# Altium project n21-dvt.PrjPcb (part 2 of 2)

## Sheet NOTECARD.SchDoc
size A3; SheetNumber: 4; SheetTotal: 7
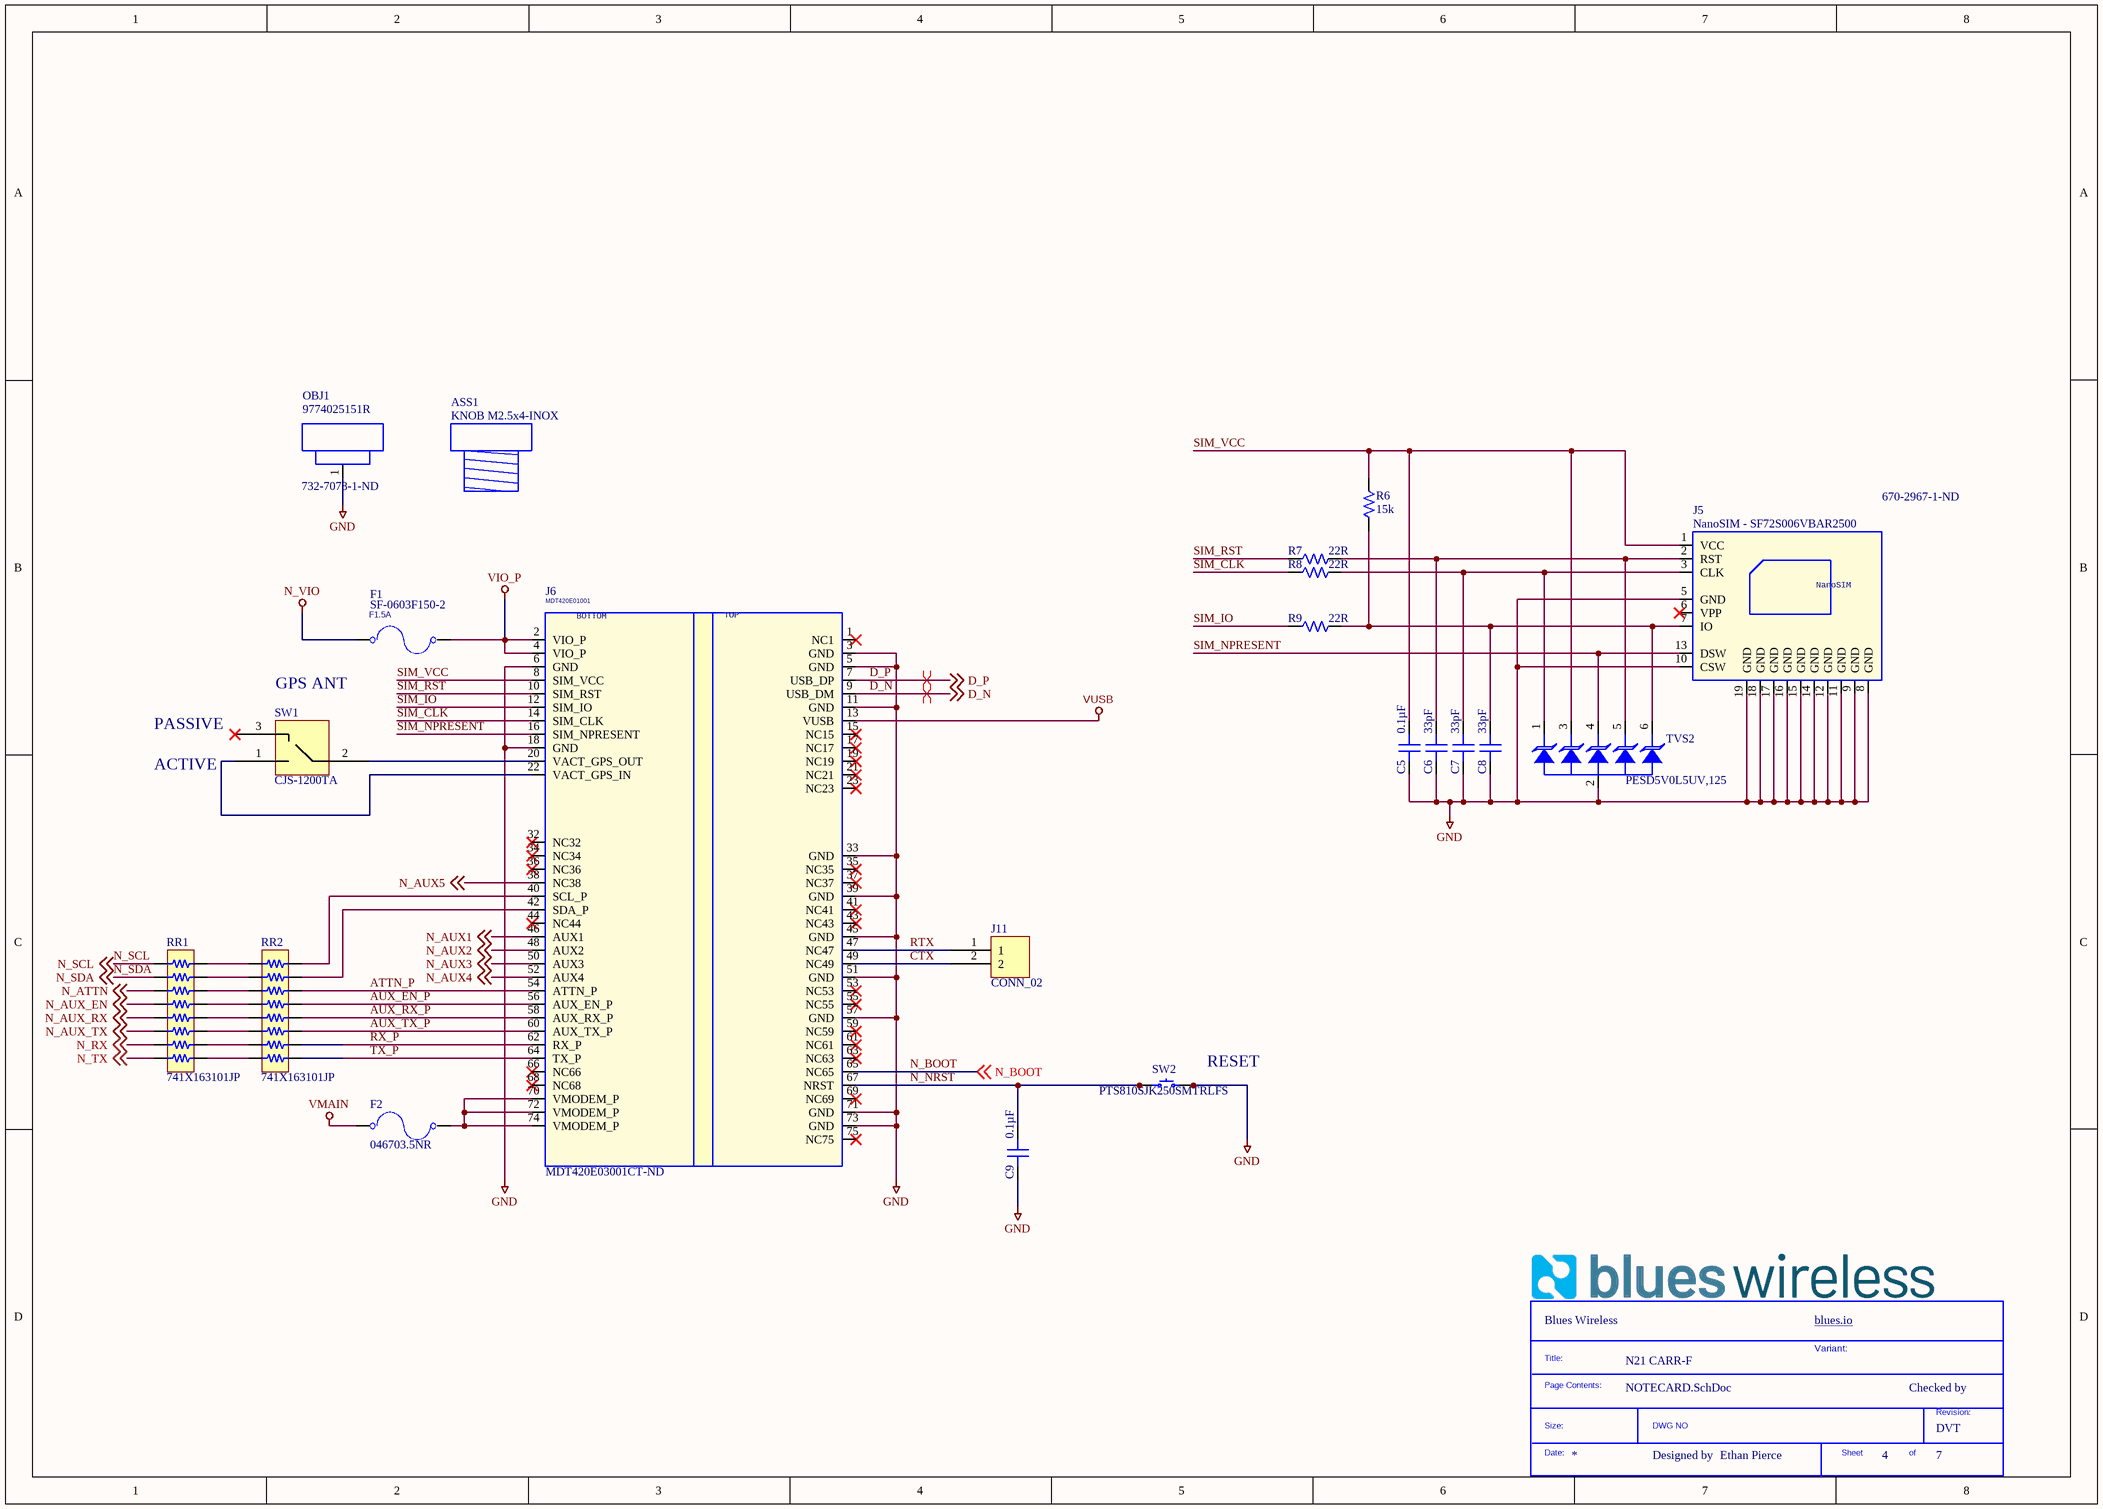
[diagram p2: NOTECARD.SchDoc]

### Parts
(Parts that share a designator on the sheet are numbered #1, #2 ... from top to bottom, then left to right.)
*?#3  SDTitleBlock  (value not drawn)  (graphical)
ASS1  KNOB M2.5x4-INOX  (mechanical)
C5  0.1µF  [CAP 0402_1005]
C6  33pF  [CAP 0402_1005]
C7  33pF  [CAP 0402_1005]
C8  33pF  [CAP 0402_1005]
C9  0.1µF  [CAP 0402_1005]
F1  SF-0603F150-2  [FS-0603]
F2  046703.5NR  [FS-0603]
J5  NanoSIM - SF72S006VBAR2500  Supplier Part Number 1: 670-2967-1-ND  [J-NANOSIM-SF72S006VBA]
J6  MDT420E01001  Supplier Part Number 1: MDT420E03001CT-ND  [J-75-0050-MOS-M2]
J11  CONN_02  [CONN_02]  (no BOM)
OBJ1  9774025151R  Supplier Part Number 1: 732-7078-1-ND  [DIST-WASMSIM0250]
R6  15k  [RES 0402_1005]
R7  22R  [RES 0402_1005]
R8  22R  [RES 0402_1005]
R9  22R  [RES 0402_1005]
RR1  741X163101JP  [RESNET 1506-16 CONVEX]
RR2  741X163101JP  [RESNET 1506-16 CONVEX]
SW1  CJS-1200TA  [SW_CJS-1200TA]
SW2  PTS810SJK250SMTRLFS  [C&K PTS810]
TVS2  PESD5V0L5UV,125  [SOT666]

### Nets
GND: C5.1 C6.1 C7.1 C8.1 C9.1 J5.5(GND) J5.8(GND) J5.9(GND) J5.10(CSW) J5.11(GND) J5.12(GND) J5.14(GND) J5.15(GND) J5.16(GND) J5.17(GND) J5.18(GND) J5.19(GND) J6.3(GND) J6.5(GND) J6.6(GND) J6.11(GND) J6.18(GND) J6.33(GND) J6.39(GND) J6.45(GND) J6.51(GND) J6.57(GND) J6.71(GND) J6.73(GND) OBJ1.1 SW2.3 SW2.4 TVS2.2(A2)
N_VIO: F1.1
VIO_P: F1.2 J6.2(VIO_P) J6.4(VIO_P)
VMAIN: F2.1
VUSB: J6.13(VUSB)
ATTN_P: J6.54(ATTN_P) RR2.14
AUX_EN_P: J6.56(AUX_EN_P) RR2.13
AUX_RX_P: J6.58(AUX_RX_P) RR2.12
AUX_TX_P: J6.60(AUX_TX_P) RR2.11
CTX: J6.49(NC49) J11.2
D_N: J6.9(USB_DM) ; off-sheet D_N
D_P: J6.7(USB_DP) ; off-sheet D_P
N_ATTN: RR1.3 ; off-sheet N_ATTN
N_AUX1: J6.46(AUX1) ; off-sheet N_AUX1
N_AUX2: J6.48(AUX2) ; off-sheet N_AUX2
N_AUX3: J6.50(AUX3) ; off-sheet N_AUX3
N_AUX4: J6.52(AUX4) ; off-sheet N_AUX4
N_AUX5: J6.38(NC38) ; off-sheet N_AUX5
N_AUX_EN: RR1.4 ; off-sheet N_AUX_EN
N_AUX_RX: RR1.5 ; off-sheet N_AUX_RX
N_AUX_TX: RR1.6 ; off-sheet N_AUX_TX
N_BOOT: J6.65(NC65) ; off-sheet N_BOOT
N_NRST: C9.2 J6.67(NRST) SW2.1 SW2.2
N_RX: RR1.7 ; off-sheet N_RX
N_SCL: RR1.1 ; off-sheet N_SCL
N_SDA: RR1.2 ; off-sheet N_SDA
N_TX: RR1.8 ; off-sheet N_TX
RTX: J6.47(NC47) J11.1
RX_P: J6.62(RX_P) RR2.10
SIM_CLK: J6.14(SIM_CLK) R8.1
SIM_IO: J6.12(SIM_IO) R9.1
SIM_NPRESENT: J5.13(DSW) J6.16(SIM_NPRESENT) TVS2.4(C4)
SIM_RST: J6.10(SIM_RST) R7.1
SIM_VCC: C5.2 J5.1(VCC) J6.8(SIM_VCC) R6.2 TVS2.3(C3)
TX_P: J6.64(TX_P) RR2.9
NetC6_2: C6.2 J5.2(RST) R7.2 TVS2.5(A5)
NetC7_2: C7.2 J5.3(CLK) R8.2 TVS2.1(C1)
NetC8_2: C8.2 J5.7(IO) R6.1 R9.2 TVS2.6(C6)
NetF2_2: F2.2 J6.70(VMODEM_P) J6.72(VMODEM_P) J6.74(VMODEM_P)
NetJ6_20: J6.20(VACT_GPS_OUT) SW1.2
NetJ6_22: J6.22(VACT_GPS_IN) SW1.1
NetJ6_40: J6.40(SCL_P) RR2.16
NetJ6_42: J6.42(SDA_P) RR2.15
NetRR1_9: RR1.9 RR2.8
NetRR1_10: RR1.10 RR2.7
NetRR1_11: RR1.11 RR2.6
NetRR1_12: RR1.12 RR2.5
NetRR1_13: RR1.13 RR2.4
NetRR1_14: RR1.14 RR2.3
NetRR1_15: RR1.15 RR2.2
NetRR1_16: RR1.16 RR2.1

Not connected (* = marked no-connect by the designer): J5 6(VPP)*; J6 1(NC1)* 15(NC15)* 17(NC17)* 19(NC19)* 21(NC21)* 23(NC23)* 32(NC32)* 34(NC34)* 35(NC35)* 36(NC36)* 37(NC37)* 41(NC41)* 43(NC43)* 44(NC44)* 53(NC53)* 55(NC55)* 59(NC59)* 61(NC61)* 63(NC63)* 66(NC66)* 68(NC68)* 69(NC69)* 75(NC75)*; SW1 3*

### Layout directives
differential pair: D_N, D_P

### Notes on the sheet
- GPS ANT
- ACTIVE
- PASSIVE
- (near SW2) RESET
- Variant:
- Checked by
- Designed by
- (in symbol AMPHENOL-75 - M-2 KEY E_13) BOTTOM; TOP
- (in symbol RAPIDO - SF-0603F150-2-1.5A/32V) F1.5A
- (in symbol SDTitleBlock) Title:; Page Contents:; Revision:; Size:; DWG NO; Date:; Sheet; of

### Library data of the parts
ASS1 = KNOB - M2.5x4-INOX: VITE TCEI 2.5X4 ESAGONO INCASSATO A2 INOX; Pkg Type: THT; Famiglia: MECCANICA; Caratteristiche: M2.5; Price Distributor Cad: 0,06; Modello: KNOB
C5 C9 = CL05B104KO5NNNC: CAP CER 0.1UF 16V X7R 0402; Manufacturer: Samsung Electro-Mechanics; Tolerance: ±10%; Part Number: CL05B104KO5NNNC; Value: 0.1µF; Applications: General Purpose; Capacitance: 0.1µF; ComponentLink1Description: Datasheet; ComponentLink1URL: http://www.samsungsem.com/kr/support/product-search/mlcc/CL05B104KO5NNNC.jsp; ComponentLink2Description: DigiKey Link; ComponentLink2URL: http://digikey.com/product-detail/en/samsung-electro-mechanics/CL05B104KO5NNNC/1276-1001-1-ND/3889087; Device Package: 0402 (1005 Metric); LastUpdated: 9/2/2020 1:02:15 AM; Lifecycle Status: Active; Minimum Order: 1; Mounting Type: Surface Mount, MLCC; Operating Temperature: -55°C ~ 125°C; Package / Case: 0402 (1005 Metric); Packaging: CutTape; PartId: 6066; Part Status: Active; Price: 0.10; Series: CL; Size / Dimension: 0.039" L x 0.020" W (1.00mm x 0.50mm); Supplier 1: DigiKey; Supplier Part Number 1: 1276-1001-1-ND; Temperature Coefficient: X7R; Thickness (Max): 0.022" (0.55mm); Voltage - Rated: 16V
C6-C8 = CL05C330JB5NNNC: CAP CER 33PF 50V C0G/NP0 0402; Manufacturer: Samsung Electro-Mechanics; Temperature Coefficient: C0G, NP0; Tolerance: ±5%; Part Number: CL05C330JB5NNNC; Value: 33pF; Applications: General Purpose; Capacitance: 33pF; ComponentLink1Description: Datasheet; ComponentLink1URL: http://www.samsungsem.com/kr/support/product-search/mlcc/CL05C330JB5NNNC.jsp; ComponentLink2Description: DigiKey Link; ComponentLink2URL: http://digikey.com/product-detail/en/samsung-electro-mechanics/CL05C330JB5NNNC/1276-1272-1-ND/3889358; Device Package: 0402 (1005 Metric); LastUpdated: 9/2/2020 1:02:02 AM; Lifecycle Status: Active; Minimum Order: 1; Mounting Type: Surface Mount, MLCC; Operating Temperature: -55°C ~ 125°C; Package / Case: 0402 (1005 Metric); Packaging: CutTape; PartId: 11655; Part Status: Active; Price: 0.10; Series: CL; Size / Dimension: 0.039" L x 0.020" W (1.00mm x 0.50mm); Supplier 1: DigiKey; Supplier Part Number 1: 1276-1272-1-ND; Thickness (Max): 0.022" (0.55mm); Voltage - Rated: 50V
F1 = RAPIDO - SF-0603F150-2-1.5A/32V: FUSIBILE RAPIDO 1.5A 32V 0603 SF-0603F150-2 BOURNS SMT; Database: 32505; Pkg Type: SMD; Temp Range: -40°..+105°; Caratteristiche: 1.5A/32V; Distributor: FAE; Famiglia: FUSIBILE; Modello: RAPIDO; Price Distributor Cad: 0,1669; Manufacturer Part Number 1: SF-0603F150-2; PCB Footprint: FS-0603; Manufacturer 1: BOURNS
F2 = 046703.5NR: Fuse Chip Very Fast Acting 3.5A 32V SMD Solder Pad 0603 T/R CSA; Manufacturer 1: Littelfuse; Body Material: Thermoplastic; DC Cold Resistance: 13.9mR; Fuse Type: Board Mount (Cartridge Style Excluded); Resistance: 15mR; Power Dissipation: 259.9mW; Approvals: UL,CSA; Supplier 1: Digi-Key; Manufacturer Part Number 1: 046703.5NR; RoHS: Yes; Category: Fuses; Stock 1: 384; Pricing 1: 1=1.35000, 5=1.31000, 10=1.22600, 50=1.01440, 100=0.84540, 250=0.82428, 500=0.69746, 1000=0.61292 (USD); Mount: Surface Mount; Case/Package: 0603; Case Code (Metric): 1608; Case Code (Imperial): 0603; Min Operating Temperature: -55°C; Max Operating Temperature: 90°C; Voltage Rating (AC): 32V; Voltage Rating (DC): 32V; Current Rating: 3.5A; Packaging: Tape and Reel; Package Quantity: 5000; Series: 467; Voltage Rating: 32V; Termination: SMD/SMT; Fuse Current: 3.5A; Working Voltage: 32V; Length: 1.6mm; Width: 1.09mm; Height: 0.012inch; Depth: 0.81mm; RoHS Compliant: Yes; REACH SVHC: Unknown; Lead Free: Lead Free; ComponentLink1URL: https://datasheet.ciiva.com/299/467-299333.pdf?src-supplier=Digi-Key; ComponentLink1Description: https://datasheet.ciiva.com/299/467-299333.pdf?src-supplier=Digi-Key; ComponentLink2URL: https://datasheet.ciiva.com/299/467-299334.pdf?src-supplier=Digi-Key; ComponentLink2Description: https://datasheet.ciiva.com/299/467-299334.pdf?src-supplier=Digi-Key; ComponentLink3URL: https://datasheet.ciiva.com/299/467-299335.pdf?src-supplier=Digi-Key; ComponentLink3Description: https://datasheet.ciiva.com/299/467-299335.pdf?src-supplier=Digi-Key; ComponentLink4URL: https://datasheet.ciiva.com/1549/48494-1549730.pdf?src-supplier=Element14; ComponentLink4Description: https://datasheet.ciiva.com/1549/48494-1549730.pdf?src-supplier=Element14; ComponentLink5URL: https://datasheet.ciiva.com/16327/467-16327451.pdf?src-supplier=Future+Electronics; ComponentLink5Description: https://datasheet.ciiva.com/16327/467-16327451.pdf?src-supplier=Future+Electronics; Supplier Part Number 1: F1400CT-ND
J5 = NANOSIM - J-NANOSIM-SF72S006VBA: CONN. NANOSIM 8P F/90° PUSH-PUSH SF72S006VBAR2500 JAE ELECTRONICS SMT; Pkg Type: SMD; Temp Range: -25°..+85°; Database: 41049; Famiglia: CONNETTORE; ROOM: NANO-SIM; Distributor: FAE; Price Distributor Cad: 0,7362; Modello: NanoSIM; PCB Footprint: J-NANOSIM-SF72S006VBA; Supplier 1: Digi-Key
J6 = AMPHENOL-75 - M-2 KEY E_13: CONN. M.2 75P M/90° P=0.5 MDT420E01001 AMPHENOL SMT; Famiglia: CONNETTORE; Pkg Type: SMD; Temp Range: -40°..+80°; ROOM: M2 CONNECTOR; PCB Footprint: J-75-0050-MOS-M2-E; Caratteristiche: 75P; Distributor: D-MDT420E01001CT-ND; Price Distributor Cad: 1,21; Supplier 1: Digi-Key
J11 = CONN_02: 0,1" 2 PIN Header
OBJ1 = DISTANZIALE - M2.5x0250: DISTANZ. CIL. METALLO 5.1X2.5 9774025151R W.E SMT; Pkg Type: SMD; Famiglia: MECCANICA; Database: 44635; Caratteristiche: M2.5; Price Distributor Cad: 0,6225; Modello: DISTANZIALE; Distributor: FAE; PCB Footprint: DIST-WASMSIM0250; Supplier 1: Digi-Key
R6 = PFR05S-153-FNH: Res SMD 15 Kohm 1% 1/16W 0402; Manufacturer: Cyntec; Supplier 1: Digi-Key; Manufacturer Part Number: PFR05S-153-FNH; RoHS: Yes; Category: Chip SMD Resistors; Stock 1: 3928; Pricing 1: 1=0.10000, 10=0.01500, 100=0.00590, 1000=0.00265, 2500=0.00230, 5000=0.00190 (USD); RoHS Compliant: Yes; Supplier Part Number 1: 2037-PFR05S-153-FNHCT-ND
R7-R9 = RC0402FR-0722RL: Res Thick Film 0402 22 Ohm 1% 0.063W(1/16W) ±100ppm/C Pad SMD T/R; Manufacturer: Yageo; Voltage Rating: 50V; Power Rating: 63mW; Temperature Coefficient: 100ppm/°C; Supplier 1: Digi-Key; Manufacturer Part Number: RC0402FR-0722RL; RoHS: Yes; Category: Chip SMD Resistors; Stock 1: 1796; Pricing 1: 1=0.10000, 10=0.01600, 100=0.00660, 1000=0.00299, 2500=0.00259, 5000=0.00214 (USD); Case/Package: 0402; Number of Pins: 2; Case Code (Imperial): 0402; Case Code (Metric): 1005; Size Code: 0402; Min Operating Temperature: -55°C; Max Operating Temperature: 155°C; Resistor Type: Thick Film; Voltage Rating (DC): 50V; Resistance: 22R; Tolerance: 1%; Packaging: Tape and Reel; Termination: SMD/SMT; Features: Moisture Resistant; Series: RC; Max Power Dissipation: 63mW; Number of Terminations: 2; Resistance Tolerance: 1%; Technology: THICK FILM; Construction: Rectangular; Length: 1mm; Width: 0.5mm; Height: 0.32mm; Depth: 0.5mm; RoHS Compliant: Yes; REACH SVHC: Unknown; Military Standard: Not; Lead Free: Lead Free; ComponentLink1URL: https://datasheet.ciiva.com/11819/0900766b80c66297-11819462.pdf?src-supplier=RSComponents; ComponentLink1Description: https://datasheet.ciiva.com/11819/0900766b80c66297-11819462.pdf?src-supplier=RSComponents; ComponentLink2URL: https://datasheet.ciiva.com/16930/pyu-rc0402-51-rohs-l-6-r-16930687.pdf?src-supplier=Future+Electronics; ComponentLink2Description: https://datasheet.ciiva.com/16930/pyu-rc0402-51-rohs-l-6-r-16930687.pdf?src-supplier=Future+Electronics; ComponentLink3URL: https://datasheet.ciiva.com/7849/1018594-7849911.pdf?src-supplier=Element14; ComponentLink3Description: https://datasheet.ciiva.com/7849/1018594-7849911.pdf?src-supplier=Element14; ComponentLink4URL: https://datasheet.ciiva.com/7849/1018594-7849912.pdf?src-supplier=Element14; ComponentLink4Description: https://datasheet.ciiva.com/7849/1018594-7849912.pdf?src-supplier=Element14; ComponentLink5URL: https://datasheet.ciiva.com/26829/getdatasheetpartid-554995-26829991.pdf?src-supplier=Verical; ComponentLink5Description: https://datasheet.ciiva.com/26829/getdatasheetpartid-554995-26829991.pdf?src-supplier=Verical; Supplier Part Number 1: 311-22.0LRCT-ND
RR1 RR2 = 741X163101JP: RES ARRAY 8 RES 100 OHM 1506; Manufacturer: CTS Resistor Products; Circuit Type: Isolated; Number of Resistors: 8; Power Per Element: 62.5mW; Resistance (Ohms): 100; Temperature Coefficient: ±200ppm/°C; Tolerance: ±5%; Part Number: 741X163101JP; ComponentLink1Description: Datasheet; ComponentLink1URL: https://www.ctscorp.com/wp-content/uploads/74x.pdf; ComponentLink2Description: DigiKey Link; ComponentLink2URL: http://digikey.com/product-detail/en/cts-resistor-products/741X163101JP/741X163101JPCT-ND/1124597; Height - Seated (Max): 0.022" (0.55mm); LastUpdated: 9/2/2020 1:23:29 AM; Lifecycle Status: Active; Minimum Order: 1; Mounting Type: Surface Mount; Number of Pins: 16; Operating Temperature: -55°C ~ 125°C; Package / Case: 1506, Convex, Long Side Terminals; Packaging: TapeAndReel; PartId: 627; Part Status: Active; Price: 0.07; Series: 741; Size / Dimension: 0.156" L x 0.063" W (3.95mm x 1.60mm); Supplier 1: DigiKey; Supplier Part Number 1: 741X163101JPCT-ND
SW1 = CJS-1200TA: Switch Slide N.O./N.C. SPDT Raised Slide 0.1A 24VDC J-Hook SMD Embossed T/R; Manufacturer: Nidec Copal; Body Material: Polyphenylene; Voltage Rating (DC): 6V; Electrical Life: 200Cycles; Max Voltage Rating (DC): 24V; Current Rating: 100mA; Number of Positions: 2; Actuator Type: Slide (Standard); Washable: Yes; Supplier 1: Digi-Key; Manufacturer Part Number: CJS-1200TA; RoHS: Yes; Category: Slide Switches; Pricing 1: 1=0.81000, 10=0.78400, 25=0.75440, 100=0.65470, 250=0.59736, 500=0.55510 (USD); Mount: Surface Mount; Contact Material: Copper Alloy; Contact Plating: Gold; Min Operating Temperature: -40°C; Max Operating Temperature: 85°C; Packaging: Tape and Reel; Throw Configuration: SPDT; Termination: J-Hook; Series: CJS; Orientation: Vertical; Length: 0.212inch; Radiation Hardening: No; RoHS Compliant: Yes; Lead Free: Lead Free; ComponentLink1URL: https://datasheet.ciiva.com/2864/cjs-2864476.pdf?src-supplier=Digi-Key; ComponentLink1Description: https://datasheet.ciiva.com/2864/cjs-2864476.pdf?src-supplier=Digi-Key; ComponentLink2URL: https://datasheet.ciiva.com/2864/cjs-2864477.pdf?src-supplier=Digi-Key; ComponentLink2Description: https://datasheet.ciiva.com/2864/cjs-2864477.pdf?src-supplier=Digi-Key; ComponentLink3URL: https://datasheet.ciiva.com/2864/cjs-2864478.pdf?src-supplier=Digi-Key; ComponentLink3Description: https://datasheet.ciiva.com/2864/cjs-2864478.pdf?src-supplier=Digi-Key; Supplier Part Number 1: 563-1021-6-ND
SW2 = PTS810SJK250SMTRLFS: PTS810 Series SPST Off-MOM 0.05 A 16 V Top Actuated SMT Tactile Switch; Manufacturer: ITT C&K; Mechanical Life: 50000Cycles; Operating Force: 260gf; Max Current Rating: 50mA; Voltage Rating (DC): 16V; Illumination Type: Non-Illuminated; Switch Travel: 0.15mm; Actuator Type: Standard; Supplier 1: Digi-Key; Manufacturer Part Number: PTS810SJK250SMTRLFS; RoHS: Yes; Category: Tactile Switches; Stock 1: 57; Pricing 1: 1=0.34000, 10=0.32600, 25=0.30880, 100=0.27980, 250=0.25504, 500=0.23706, 1000=0.20223 (USD); Mount: Surface Mount; Case/Package: SMD/SMT; Color: White; Contact Plating: Silver; Min Operating Temperature: -40°C; Max Operating Temperature: 85°C; Throw Configuration: SPST; Packaging: Tape and Reel; Termination: J-Bend; Current Rating: 50mA; Package Quantity: 2900; Orientation: Straight; Switch Function: Off-Mom; Length: 3.2mm; Depth: 4.6mm; Lead Free: Lead Free; RoHS Compliant: Yes; ComponentLink1URL: https://datasheet.ciiva.com/18514/pts810-4mar13-18514061.pdf?src-supplier=Digi-Key; ComponentLink1Description: https://datasheet.ciiva.com/18514/pts810-4mar13-18514061.pdf?src-supplier=Digi-Key; ComponentLink2URL: https://datasheet.ciiva.com/18514/pts810-4mar13-18514062.pdf?src-supplier=Digi-Key; ComponentLink2Description: https://datasheet.ciiva.com/18514/pts810-4mar13-18514062.pdf?src-supplier=Digi-Key; ComponentLink3URL: https://datasheet.ciiva.com/18514/pts810-4mar13-18514063.pdf?src-supplier=Digi-Key; ComponentLink3Description: https://datasheet.ciiva.com/18514/pts810-4mar13-18514063.pdf?src-supplier=Digi-Key; Supplier Part Number 1: CKN10503CT-ND
TVS2 = PESD5V0L5UV,125: PESD Series 25 W 5 V Uni-Directional Fivefold ESD Protection Diode Array SOT-666; Manufacturer: Nexperia; Supplier 1: Digi-Key; Manufacturer Part Number: PESD5V0L5UV,125; RoHS: Yes; Category: ESD and Circuit Protection ICs; Stock 1: 4000; Pricing 1: 1=0.42000, 10=0.31700, 100=0.19770, 500=0.13528, 1000=0.10406, 2000=0.09366 (USD); RoHS Compliant: Yes; Supplier Part Number 1: 1727-5797-1-ND

## Sheet FEATHER.SchDoc
size A3; SheetNumber: 5; SheetTotal: 7
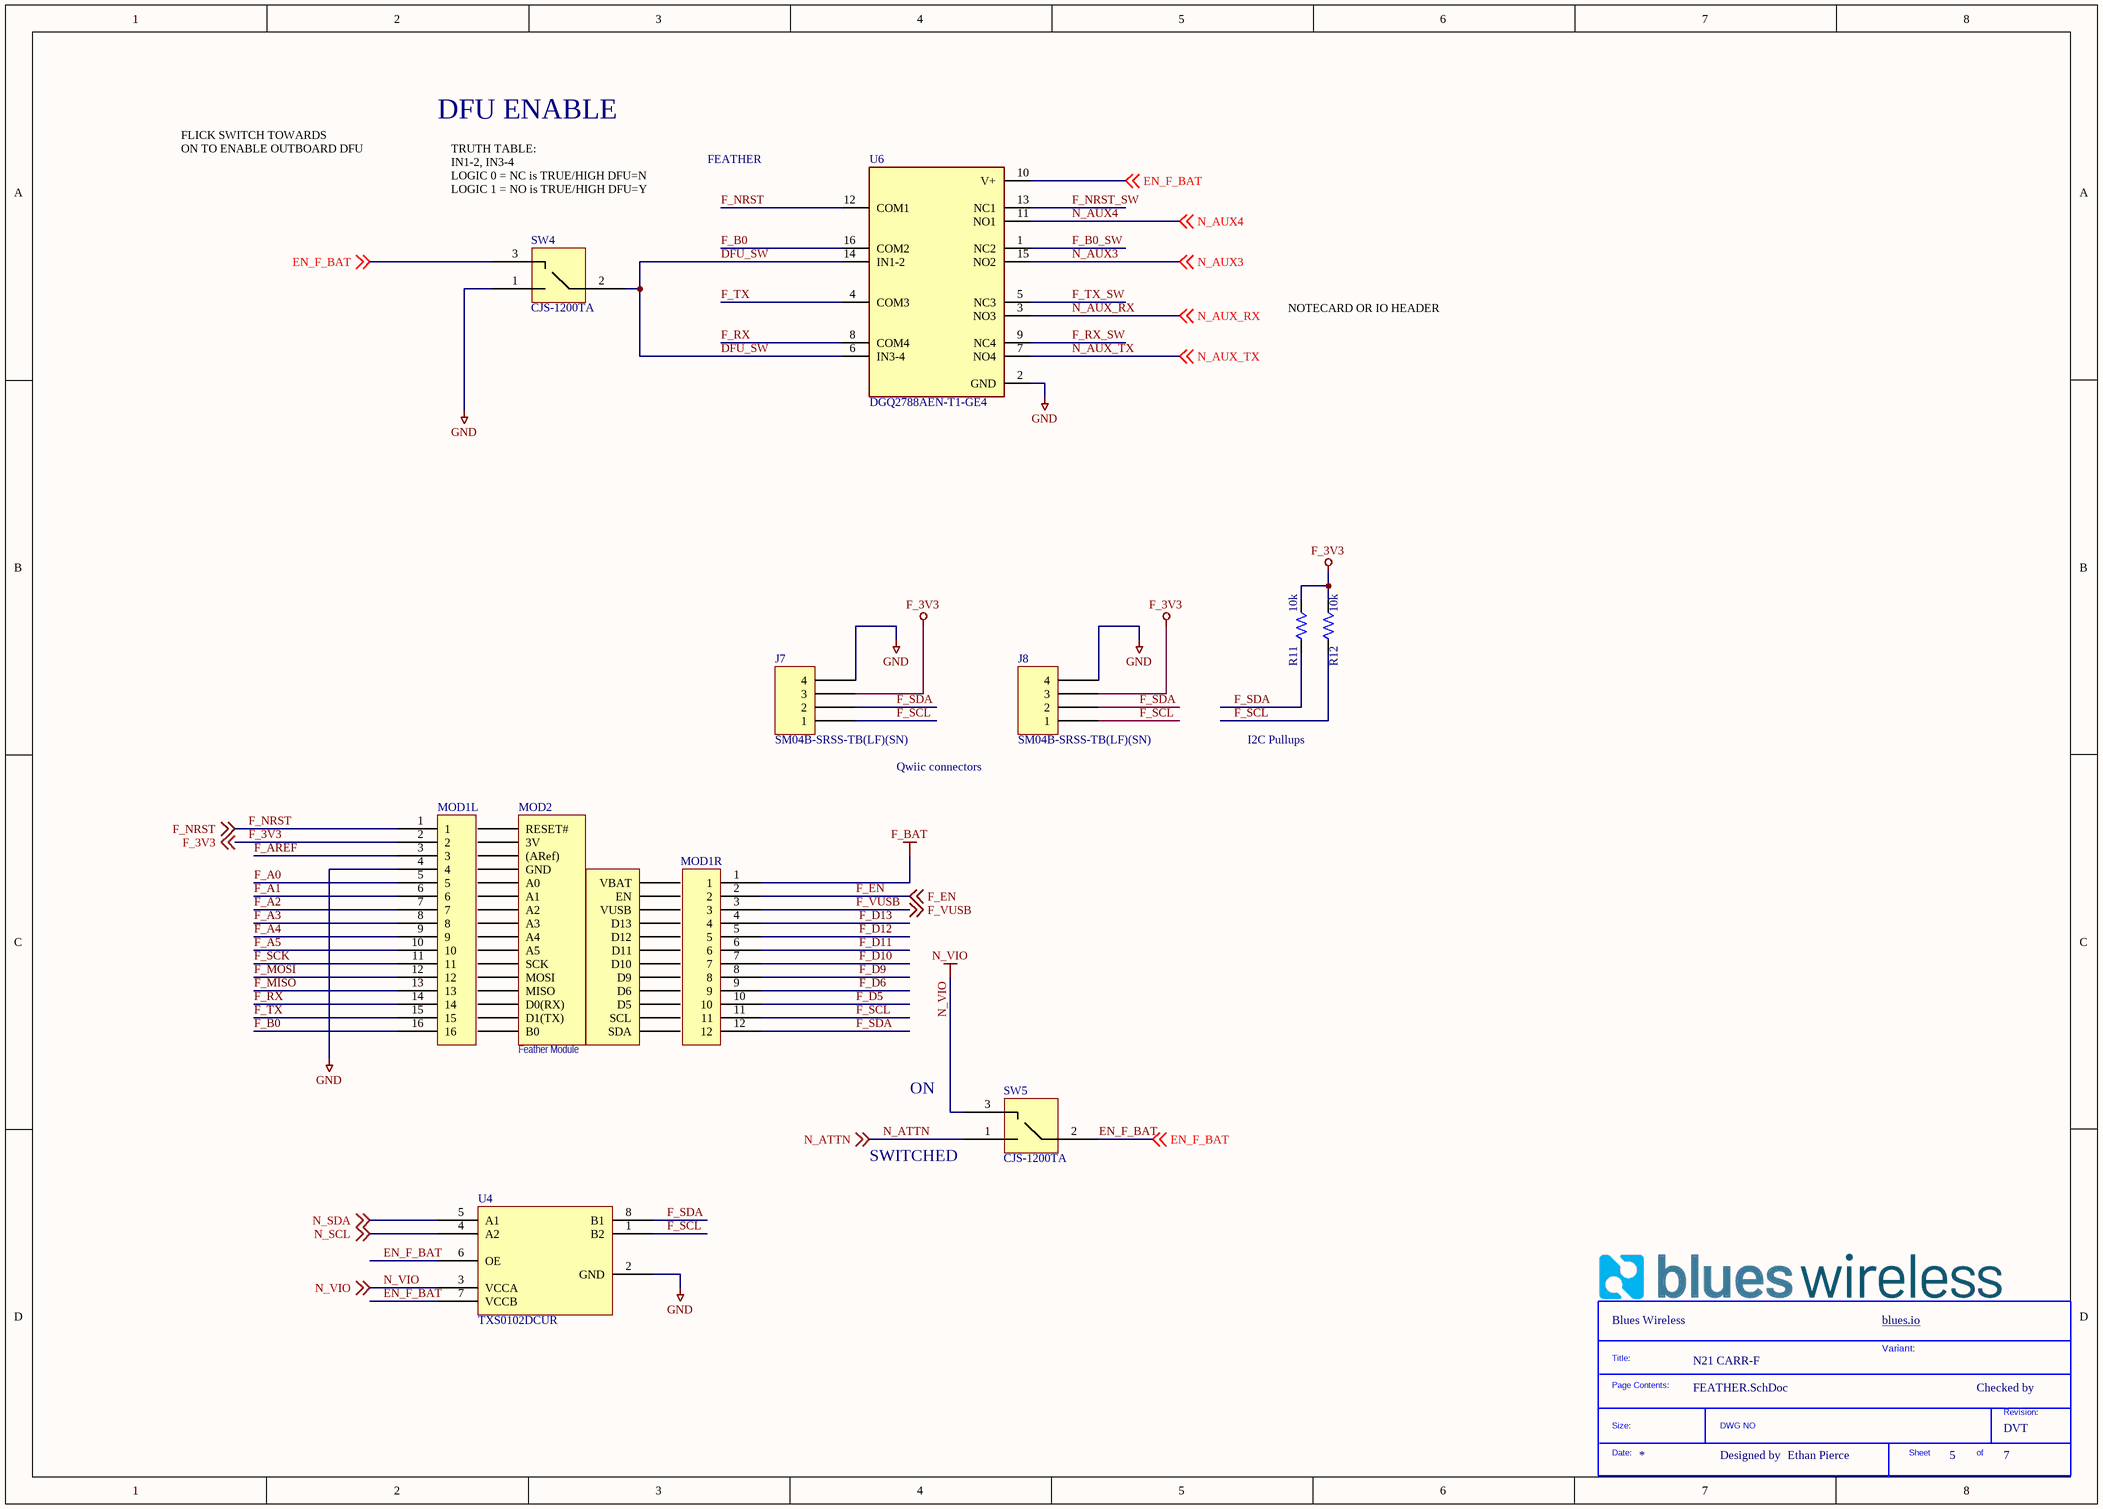
[diagram p3: FEATHER.SchDoc]

### Parts
(Parts that share a designator on the sheet are numbered #1, #2 ... from top to bottom, then left to right.)
*?#4  SDTitleBlock  (value not drawn)  (graphical)
J7  SM04B-SRSS-TB(LF)(SN)  [JST SM04B-SRSS-TB]
J8  SM04B-SRSS-TB(LF)(SN)  [JST SM04B-SRSS-TB]
MOD1L  Socket 16-Pin, 0.100 inch (0.335 inch body)  [16PIN_254MM]  (value not drawn)
MOD1R  Socket 12-Pin, 0.100 inch (0.335 inch body)  [12PIN_254MM]  (value not drawn)
MOD2  Feather Module  [BLUES_WIRELESS_SWAN_2-54_HEADERS]  (no BOM)
R11  10k  [RES 0402_1005]
R12  10k  [RES 0402_1005]
SW4  CJS-1200TA  [SW_CJS-1200TA]
SW5  CJS-1200TA  [SW_CJS-1200TA]
U4  TXS0102DCUR  [SOP50P310X90-8N]
U6  DGQ2788AEN-T1-GE4  [QFN40P260X180X60-16N]

### Nets
F_3V3: J7.3 J8.3 MOD1L.2 R11.2 R12.2 ; off-sheet F_3V3
F_BAT: MOD1R.1
GND: J7.4 J8.4 MOD1L.4 SW4.1 U4.2(GND) U6.2(GND)
N_VIO: SW5.3 U4.3(VCCA) ; off-sheet N_VIO
DFU_SW: SW4.2 U6.6(IN3-4) U6.14(IN1-2)
EN_F_BAT: SW4.3 SW5.2 U4.6(OE) U4.7(VCCB) U6.10(V+) ; off-sheet EN_F_BAT
F_A0: MOD1L.5
F_A1: MOD1L.6
F_A2: MOD1L.7
F_A3: MOD1L.8
F_A4: MOD1L.9
F_A5: MOD1L.10
F_AREF: MOD1L.3
F_B0: MOD1L.16 U6.16(COM2)
F_B0_SW: U6.1(NC2)
F_D5: MOD1R.10
F_D6: MOD1R.9
F_D9: MOD1R.8
F_D10: MOD1R.7
F_D11: MOD1R.6
F_D12: MOD1R.5
F_D13: MOD1R.4
F_EN: MOD1R.2 ; off-sheet F_EN
F_MISO: MOD1L.13
F_MOSI: MOD1L.12
F_NRST: MOD1L.1 U6.12(COM1) ; off-sheet F_NRST
F_NRST_SW: U6.13(NC1)
F_RX: MOD1L.14 U6.8(COM4)
F_RX_SW: U6.9(NC4)
F_SCK: MOD1L.11
F_SCL: J7.1 J8.1 MOD1R.11 R12.1 U4.1(B2)
F_SDA: J7.2 J8.2 MOD1R.12 R11.1 U4.8(B1)
F_TX: MOD1L.15 U6.4(COM3)
F_TX_SW: U6.5(NC3)
F_VUSB: MOD1R.3 ; off-sheet F_VUSB
N_ATTN: SW5.1 ; off-sheet N_ATTN
N_AUX3: U6.15(NO2) ; off-sheet N_AUX3
N_AUX4: U6.11(NO1) ; off-sheet N_AUX4
N_AUX_RX: U6.3(NO3) ; off-sheet N_AUX_RX
N_AUX_TX: U6.7(NO4) ; off-sheet N_AUX_TX
N_SCL: U4.4(A2) ; off-sheet N_SCL
N_SDA: U4.5(A1) ; off-sheet N_SDA

Not connected (* = marked no-connect by the designer): MOD2 1(RESET#) 2(3V) 3((ARef)) 4(GND) 5(A0) 6(A1) 7(A2) 8(A3) 9(A4) 10(A5) 11(SCK) 12(MOSI) 13(MISO) 14(D0(RX)) 15(D1(TX)) 16(B0) 17(SDA) 18(SCL) 19(D5) 20(D6) 21(D9) 22(D10) 23(D11) 24(D12) 25(D13) 26(VUSB) 27(EN) 28(VBAT)

### Notes on the sheet
- FLICK SWITCH TOWARDS
  ON TO ENABLE OUTBOARD DFU
- DFU ENABLE
- FEATHER
- (near SW4) TRUTH TABLE:
  IN1-2, IN3-4
  LOGIC 0 = NC is TRUE/HIGH DFU=N
  LOGIC 1 = NO is TRUE/HIGH DFU=Y
- NOTECARD OR IO HEADER
- Qwiic connectors
- I2C Pullups
- ON
- SWITCHED
- Variant:
- Checked by
- Designed by
- (in symbol SDTitleBlock) Title:; Page Contents:; Revision:; Size:; DWG NO; Date:; Sheet; of

### Library data of the parts
J7 J8 = SM04B-SRSS-TB(LF)(SN): CONN HEADER SH 4POS SIDE 1MM TIN; Manufacturer: JST; Number of Positions: 4; Connector Type: Male Pin; Contact Resistance: 40mR; Max Current Rating: 1A; Max Voltage Rating (AC): 50V; Pitch: 0.039inch; Supplier 1: Digi-Key; Manufacturer Part Number: SM04B-SRSS-TB(LF)(SN); RoHS: Yes; Category: Connectors; Pricing 1: 1=0.57000, 10=0.49300, 100=0.40630, 500=0.35328, 1000=0.29146 (USD); Mount: Surface Mount; Contact Material: Copper Alloy; Contact Plating: Tin,Copper; Color: Natural; Housing Color: Beige; Housing Material: Polyamide; Min Operating Temperature: -25°C; Max Operating Temperature: 85°C; Number of Rows: 1; Termination: Solder; Packaging: Tape and Reel; Orientation: Right Angle; Number of Contacts: 4; Max Voltage Rating (DC): 50V; Length: 6mm; Depth: 4.95mm; Lead Free: Lead Free; ComponentLink1URL: https://datasheet.ciiva.com/26894/getdatasheetpartid-640736-26894676.pdf?src-supplier=Verical; ComponentLink1Description: https://datasheet.ciiva.com/26894/getdatasheetpartid-640736-26894676.pdf?src-supplier=Verical; ComponentLink2URL: https://datasheet.ciiva.com/26894/getdatasheetpartid-499363-26894945.pdf?src-supplier=Verical; ComponentLink2Description: https://datasheet.ciiva.com/26894/getdatasheetpartid-499363-26894945.pdf?src-supplier=Verical; ComponentLink3URL: https://datasheet.ciiva.com/16487/jstsm04b-srss-tb-lf-sn-16487222.pdf?src-supplier=Future+Electronics; ComponentLink3Description: https://datasheet.ciiva.com/16487/jstsm04b-srss-tb-lf-sn-16487222.pdf?src-supplier=Future+Electronics; Supplier Part Number 1: 455-1804-1-ND
MOD1L = SOCKET_LFB_16: Socket 16-Pin, 0.100 in
MOD1R = SOCKET_LFB_12: Socket 12-Pin, 0.100 in
MOD2 = ADAFRUIT_FEATHER_COMMON_1: Typical Adafruit Feather Pinout
R11 R12 = RC1005F103CS: Res Thick Film 0402 10K Ohm 1% 1/16W ±100ppm/°C Molded SMD SMD T/R; Manufacturer: Samsung; Resistance: 10kR; Power Rating: 63mW; Supplier 1: Digi-Key; Manufacturer Part Number: RC1005F103CS; RoHS: Yes; Category: Chip SMD Resistors; Stock 1: 58620569; Pricing 1: 10000=0.00695 (USD); Mount: Surface Mount; Case/Package: 0402; Case Code (Metric): 1005; Case Code (Imperial): 0402; Contact Plating: Tin; Size Code: 0402; Min Operating Temperature: -55°C; Max Operating Temperature: 155°C; Tolerance: 1%; Packaging: Tape and Reel; Resistor Type: Thick Film; Package Quantity: 1; Number of Terminations: 2; Max Power Dissipation: 63mW; Temperature Coefficient: 100ppm/°C; Features: Moisture Resistant; Series: RC; Construction: Rectangular; Length: 0.039inch; Width: 0.02inch; Height: 0.016inch; Depth: 0.5mm; Radiation Hardening: No; Military Standard: Not; RoHS Compliant: Yes; ComponentLink1URL: https://datasheet.ciiva.com/15196/getdatasheetpartid-504789-15196214.pdf?src-supplier=Verical; ComponentLink1Description: https://datasheet.ciiva.com/15196/getdatasheetpartid-504789-15196214.pdf?src-supplier=Verical; ComponentLink2URL: https://datasheet.ciiva.com/16481/rcseries-16481007.pdf?src-supplier=Future+Electronics; ComponentLink2Description: https://datasheet.ciiva.com/16481/rcseries-16481007.pdf?src-supplier=Future+Electronics; Supplier Part Number 1: 1276-3431-2-ND
SW4 SW5 = CJS-1200TA: as SW1 on sheet NOTECARD; Supplier 1: Digi-Key; Manufacturer Part Number: CJS-1200TA; RoHS: Yes; Category: Slide Switches; Pricing 1: 1=0.81000, 10=0.78400, 25=0.75440, 100=0.65470, 250=0.59736, 500=0.55510 (USD); Mount: Surface Mount; Contact Material: Copper Alloy; Contact Plating: Gold; Min Operating Temperature: -40°C; Max Operating Temperature: 85°C; Packaging: Tape and Reel; Throw Configuration: SPDT; Termination: J-Hook; Series: CJS; Orientation: Vertical; Length: 0.212inch; Radiation Hardening: No; RoHS Compliant: Yes; Lead Free: Lead Free; ComponentLink1URL: https://datasheet.ciiva.com/2864/cjs-2864476.pdf?src-supplier=Digi-Key; ComponentLink1Description: https://datasheet.ciiva.com/2864/cjs-2864476.pdf?src-supplier=Digi-Key; ComponentLink2URL: https://datasheet.ciiva.com/2864/cjs-2864477.pdf?src-supplier=Digi-Key; ComponentLink2Description: https://datasheet.ciiva.com/2864/cjs-2864477.pdf?src-supplier=Digi-Key; ComponentLink3URL: https://datasheet.ciiva.com/2864/cjs-2864478.pdf?src-supplier=Digi-Key; ComponentLink3Description: https://datasheet.ciiva.com/2864/cjs-2864478.pdf?src-supplier=Digi-Key; Supplier Part Number 1: 563-1021-6-ND
U4 = TXS0102DCUR: 2-Bit Bidirectional Voltage-Level Shifter for Open-Drain and Push-Pull Application 8-VSSOP -40 to 85; Manufacturer: Texas Instruments; Min Supply Voltage: 1.65V; Max Supply Voltage: 5.5V; Data Rate: 24Mbps; Propagation Delay: 4.6ns; Logic Function: Translator; Number of Bits: 2; High Level Output Current: -20uA; Low Level Output Current: 1mA; Quiescent Current: 14.4uA; Turn-On Delay Time: 260ns; Output Current: 1A; Supplier 1: Digi-Key; Manufacturer Part Number: TXS0102DCUR; RoHS: Yes; Category: Voltage Level Shifters; Pricing 1: 1=0.80000, 10=0.70000, 25=0.65720, 100=0.53640, 250=0.49820, 500=0.42400, 1000=0.35000 (USD); Case/Package: VSSOP; Number of Pins: 8; Weight: 0.000339oz; Min Operating Temperature: -40°C; Max Operating Temperature: 85°C; Packaging: Tape and Reel; Package Quantity: 1; Number of Channels: 2; Number of Inputs: 2; Nominal Supply Current: 14.4uA; Output Type: Voltage; Radiation Hardening: No; Lead Free: Lead Free; RoHS Compliant: Yes; REACH SVHC: No SVHC; ComponentLink1URL: https://datasheet.ciiva.com/22653/1846850-22653373.pdf?src-supplier=Farnell; ComponentLink1Description: https://datasheet.ciiva.com/22653/1846850-22653373.pdf?src-supplier=Farnell; ComponentLink2URL: https://datasheet.ciiva.com/15096/getdatasheetpartid-118249-15096172.pdf?src-supplier=Verical; ComponentLink2Description: https://datasheet.ciiva.com/15096/getdatasheetpartid-118249-15096172.pdf?src-supplier=Verical; ComponentLink3URL: https://datasheet.ciiva.com/1508/1857232-1508821.pdf?src-supplier=Element14; ComponentLink3Description: https://datasheet.ciiva.com/1508/1857232-1508821.pdf?src-supplier=Element14; ComponentLink4URL: https://datasheet.ciiva.com/28499/1863639-28499676.pdf?src-supplier=Element14; ComponentLink4Description: https://datasheet.ciiva.com/28499/1863639-28499676.pdf?src-supplier=Element14; ComponentLink5URL: https://datasheet.ciiva.com/46395/1863639-46395871.pdf?src-supplier=Element14; ComponentLink5Description: https://datasheet.ciiva.com/46395/1863639-46395871.pdf?src-supplier=Element14; ComponentLink6URL: https://datasheet.ciiva.com/1899/txs0102-1899369.pdf?src-supplier=Digi-Key; ComponentLink6Description: https://datasheet.ciiva.com/1899/txs0102-1899369.pdf?src-supplier=Digi-Key; ComponentLink7URL: https://datasheet.ciiva.com/1899/txs0102-1899368.pdf?src-supplier=Digi-Key; ComponentLink7Description: https://datasheet.ciiva.com/1899/txs0102-1899368.pdf?src-supplier=Digi-Key; ComponentLink8URL: https://datasheet.ciiva.com/1899/txs0102-1899370.pdf?src-supplier=Digi-Key; ComponentLink8Description: https://datasheet.ciiva.com/1899/txs0102-1899370.pdf?src-supplier=Digi-Key; ComponentLink9URL: https://datasheet.ciiva.com/14287/txs0102-14287516.pdf?src-supplier=Avnet; ComponentLink9Description: https://datasheet.ciiva.com/14287/txs0102-14287516.pdf?src-supplier=Avnet; ComponentLink10URL: https://datasheet.ciiva.com/14287/txs0102-14287518.pdf?src-supplier=Avnet; ComponentLink10Description: https://datasheet.ciiva.com/14287/txs0102-14287518.pdf?src-supplier=Avnet; Supplier Part Number 1: 296-21931-6-ND
U6 = DGQ2788AEN-T1-GE4: Analog Switch Quad SPDT Automotive 16-Pin Mini-QFN T/R; Manufacturer: Vishay; Number of Circuits: 2; On-State Resistance: 500mR; -3db Bandwidth: 338MHz; Supplier 1: Arrow Electronics; Manufacturer Part Number: DGQ2788AEN-T1-GE4; RoHS: Yes; Category: Interface ICs; Stock 1: 341; Pricing 1: 1=1.03770, 10=0.89200, 25=0.88310, 100=0.69780, 250=0.68760 (USD); Number of Pins: 16; Min Operating Temperature: -40°C; Max Operating Temperature: 125°C; Packaging: Tape and Reel; RoHS Compliant: Yes; ComponentLink1URL: http://www.vishay.com/docs/75683/dgq2788a.pdf?src-supplier=Digi-Key; ComponentLink1Description: http://www.vishay.com/docs/75683/dgq2788a.pdf?src-supplier=Digi-Key; Supplier Part Number 1: DGQ2788AEN-T1-GE4

## Sheet IO.SchDoc
size A3; SheetNumber: 6; SheetTotal: 7
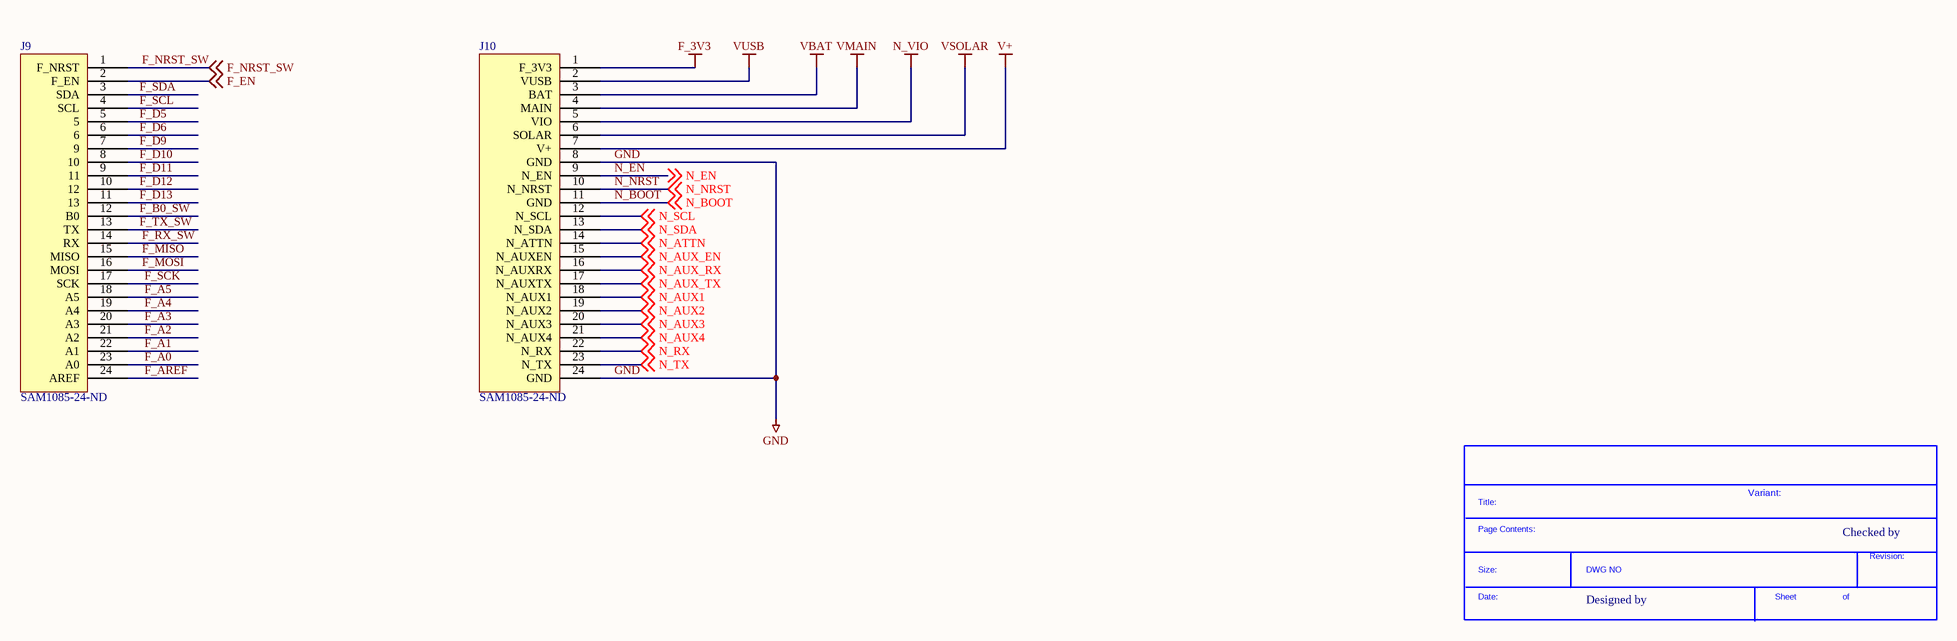
[diagram p4: IO.SchDoc]

### Parts
(Parts that share a designator on the sheet are numbered #1, #2 ... from top to bottom, then left to right.)
*?#5  SDTitleBlock  (value not drawn)  (graphical)
J9  Supplier Part Number 1: SAM1085-24-ND  [CES-124-01-S-S]  (hidden comment: 24x1)
J10  Supplier Part Number 1: SAM1085-24-ND  [CES-124-01-S-S]  (hidden comment: 24X1)

### Nets
F_3V3: J10.1(F_3V3)
GND: J10.8(GND) J10.24(GND)
N_VIO: J10.5(VIO)
V+: J10.7(V+)
VBAT: J10.3(BAT)
VMAIN: J10.4(MAIN)
VSOLAR: J10.6(SOLAR)
VUSB: J10.2(VUSB)
F_A0: J9.23(A0)
F_A1: J9.22(A1)
F_A2: J9.21(A2)
F_A3: J9.20(A3)
F_A4: J9.19(A4)
F_A5: J9.18(A5)
F_AREF: J9.24(AREF)
F_B0_SW: J9.12(B0)
F_D5: J9.5
F_D6: J9.6
F_D9: J9.7(9)
F_D10: J9.8(10)
F_D11: J9.9(11)
F_D12: J9.10(12)
F_D13: J9.11(13)
F_EN: J9.2(F_EN) ; off-sheet F_EN
F_MISO: J9.15(MISO)
F_MOSI: J9.16(MOSI)
F_NRST_SW: J9.1(F_NRST) ; off-sheet F_NRST_SW
F_RX_SW: J9.14(RX)
F_SCK: J9.17(SCK)
F_SCL: J9.4(SCL)
F_SDA: J9.3(SDA)
F_TX_SW: J9.13(TX)
N_ATTN: J10.14(N_ATTN) ; off-sheet N_ATTN
N_AUX1: J10.18(N_AUX1) ; off-sheet N_AUX1
N_AUX2: J10.19(N_AUX2) ; off-sheet N_AUX2
N_AUX3: J10.20(N_AUX3) ; off-sheet N_AUX3
N_AUX4: J10.21(N_AUX4) ; off-sheet N_AUX4
N_AUX_EN: J10.15(N_AUXEN) ; off-sheet N_AUX_EN
N_AUX_RX: J10.16(N_AUXRX) ; off-sheet N_AUX_RX
N_AUX_TX: J10.17(N_AUXTX) ; off-sheet N_AUX_TX
N_BOOT: J10.11(GND) ; off-sheet N_BOOT
N_EN: J10.9(N_EN) ; off-sheet N_EN
N_NRST: J10.10(N_NRST) ; off-sheet N_NRST
N_RX: J10.22(N_RX) ; off-sheet N_RX
N_SCL: J10.12(N_SCL) ; off-sheet N_SCL
N_SDA: J10.13(N_SDA) ; off-sheet N_SDA
N_TX: J10.23(N_TX) ; off-sheet N_TX

### Notes on the sheet
- Variant:
- Checked by
- Designed by
- (in symbol SDTitleBlock) Title:; Page Contents:; Revision:; Size:; DWG NO; Date:; Sheet; of

### Library data of the parts
J9 = SIDECON: 24x1 0.1" pitch half height female header; PN: DNM; Supplier 1: Digi-Key
J10 = SIDECON_N: 24x1 0.1" pitch half height female header; PN: DNM; Supplier 1: Digi-Key

## Sheet REVISION HISTORY.SchDoc
size A3; DocumentNumber: 4; SheetNumber: 7; SheetTotal: 7
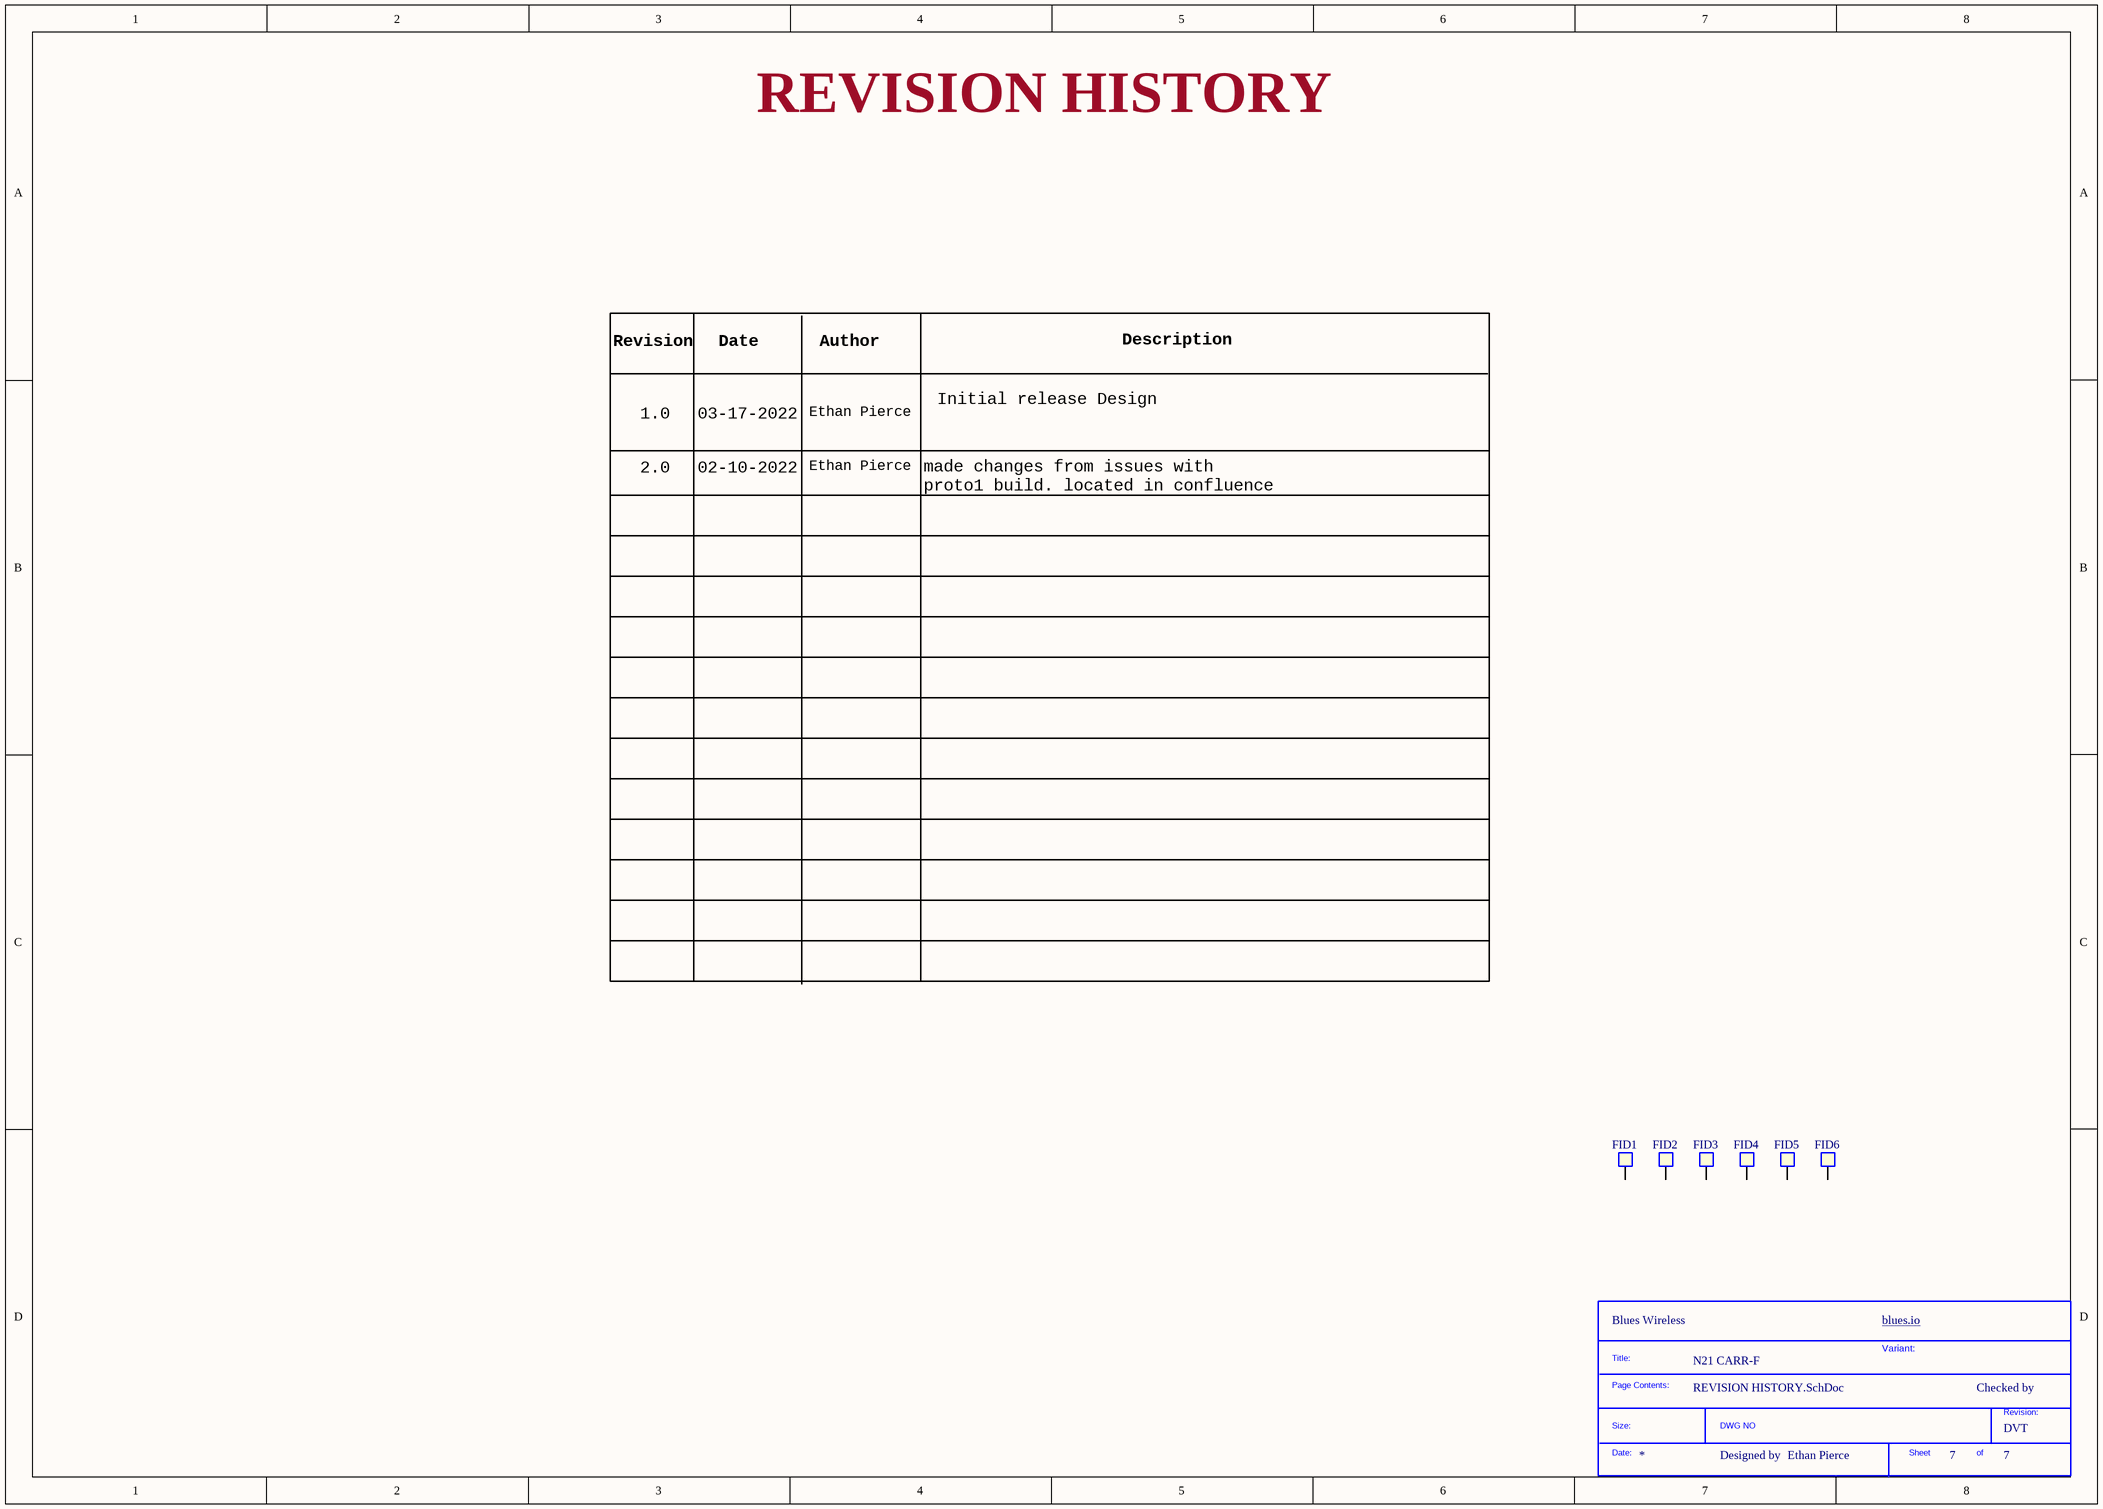
[diagram p5: REVISION HISTORY.SchDoc]

### Parts
(Parts that share a designator on the sheet are numbered #1, #2 ... from top to bottom, then left to right.)
*?#6  SDTitleBlock  (value not drawn)  (graphical)
FID1  TPS  [FIDUCIAL]  (value not drawn)  (no BOM)
FID2  TPS  [FIDUCIAL]  (value not drawn)  (no BOM)
FID3  TPS  [FIDUCIAL]  (value not drawn)  (no BOM)
FID4  TPS  [FIDUCIAL]  (value not drawn)  (no BOM)
FID5  TPS  [FIDUCIAL]  (value not drawn)  (no BOM)
FID6  TPS  [FIDUCIAL]  (value not drawn)  (no BOM)

### Nets

Not connected (* = marked no-connect by the designer): FID1 1(TP); FID2 1(TP); FID3 1(TP); FID4 1(TP); FID5 1(TP); FID6 1(TP)

### Notes on the sheet
- REVISION HISTORY
- Revision
- Date
- Author
- Description
- 1.0
- 03-17-2022
- Initial release Design
- 2.0
- 02-10-2022
- made changes from issues with proto1 build. located in confluence
- Variant:
- Checked by
- Designed by
- (in symbol SDTitleBlock) Title:; Page Contents:; Revision:; Size:; DWG NO; Date:; Sheet; of

### Library data of the parts
FID1-FID6 = FIDUCIAL: Pkg Type: SMD; Distributor: FAE; PCB Footprint: FIDUCIAL

## Nets that join several sheets
F_3V3: FEATHER (5 pins), IO (J10.1)
F_BAT: POWER (DS5.3), FEATHER (MOD1R.1)
GND: POWER (39 pins), NOTECARD (33 pins), FEATHER (6 pins), IO (J10.8 J10.24)
N_VIO: POWER (C10.1 C11.2 R1.2 U5.1), NOTECARD (F1.1), FEATHER (SW5.3 U4.3), IO (J10.5)
V+: POWER (DS1.1 DS1.2 J1.2), IO (J10.7)
VBAT: POWER (6 pins), IO (J10.3)
VMAIN: POWER (15 pins), NOTECARD (F2.1), IO (J10.4)
VSOLAR: POWER (C1.1 DS4.1 DS4.2 J2.2), IO (J10.6)
VUSB: POWER (C3.1 DS3.1 DS6.1 J4.1), NOTECARD (J6.13), IO (J10.2)
D_N: POWER (J4.2), NOTECARD (J6.9)
D_P: POWER (J4.3), NOTECARD (J6.7)
EN_F_BAT: POWER (U3.12), FEATHER (5 pins)
F_A0: FEATHER (MOD1L.5), IO (J9.23)
F_A1: FEATHER (MOD1L.6), IO (J9.22)
F_A2: FEATHER (MOD1L.7), IO (J9.21)
F_A3: FEATHER (MOD1L.8), IO (J9.20)
F_A4: FEATHER (MOD1L.9), IO (J9.19)
F_A5: FEATHER (MOD1L.10), IO (J9.18)
F_AREF: FEATHER (MOD1L.3), IO (J9.24)
F_B0_SW: FEATHER (U6.1), IO (J9.12)
F_D5: FEATHER (MOD1R.10), IO (J9.5)
F_D6: FEATHER (MOD1R.9), IO (J9.6)
F_D9: FEATHER (MOD1R.8), IO (J9.7)
F_D10: FEATHER (MOD1R.7), IO (J9.8)
F_D11: FEATHER (MOD1R.6), IO (J9.9)
F_D12: FEATHER (MOD1R.5), IO (J9.10)
F_D13: FEATHER (MOD1R.4), IO (J9.11)
F_EN: FEATHER (MOD1R.2), IO (J9.2)
F_MISO: FEATHER (MOD1L.13), IO (J9.15)
F_MOSI: FEATHER (MOD1L.12), IO (J9.16)
F_NRST_SW: FEATHER (U6.13), IO (J9.1)
F_RX_SW: FEATHER (U6.9), IO (J9.14)
F_SCK: FEATHER (MOD1L.11), IO (J9.17)
F_SCL: FEATHER (5 pins), IO (J9.4)
F_SDA: FEATHER (5 pins), IO (J9.3)
F_TX_SW: FEATHER (U6.5), IO (J9.13)
F_VUSB: POWER (DS7.1), FEATHER (MOD1R.3)
N_ATTN: NOTECARD (RR1.3), FEATHER (SW5.1), IO (J10.14)
N_AUX1: NOTECARD (J6.46), IO (J10.18)
N_AUX2: NOTECARD (J6.48), IO (J10.19)
N_AUX3: NOTECARD (J6.50), FEATHER (U6.15), IO (J10.20)
N_AUX4: NOTECARD (J6.52), FEATHER (U6.11), IO (J10.21)
N_AUX5: POWER (R1.1 U2.8), NOTECARD (J6.38)
N_AUX_EN: NOTECARD (RR1.4), IO (J10.15)
N_AUX_RX: NOTECARD (RR1.5), FEATHER (U6.3), IO (J10.16)
N_AUX_TX: NOTECARD (RR1.6), FEATHER (U6.7), IO (J10.17)
N_BOOT: NOTECARD (J6.65), IO (J10.11)
N_EN: POWER (C19.1 R16.1 U1.B1), IO (J10.9)
N_NRST: NOTECARD (C9.2 J6.67 SW2.1 SW2.2), IO (J10.10)
N_RX: NOTECARD (RR1.7), IO (J10.22)
N_SCL: NOTECARD (RR1.1), FEATHER (U4.4), IO (J10.12)
N_SDA: NOTECARD (RR1.2), FEATHER (U4.5), IO (J10.13)
N_TX: NOTECARD (RR1.8), IO (J10.23)